# EAGLE design ChronoDotV2 (EAGLE 5.10)
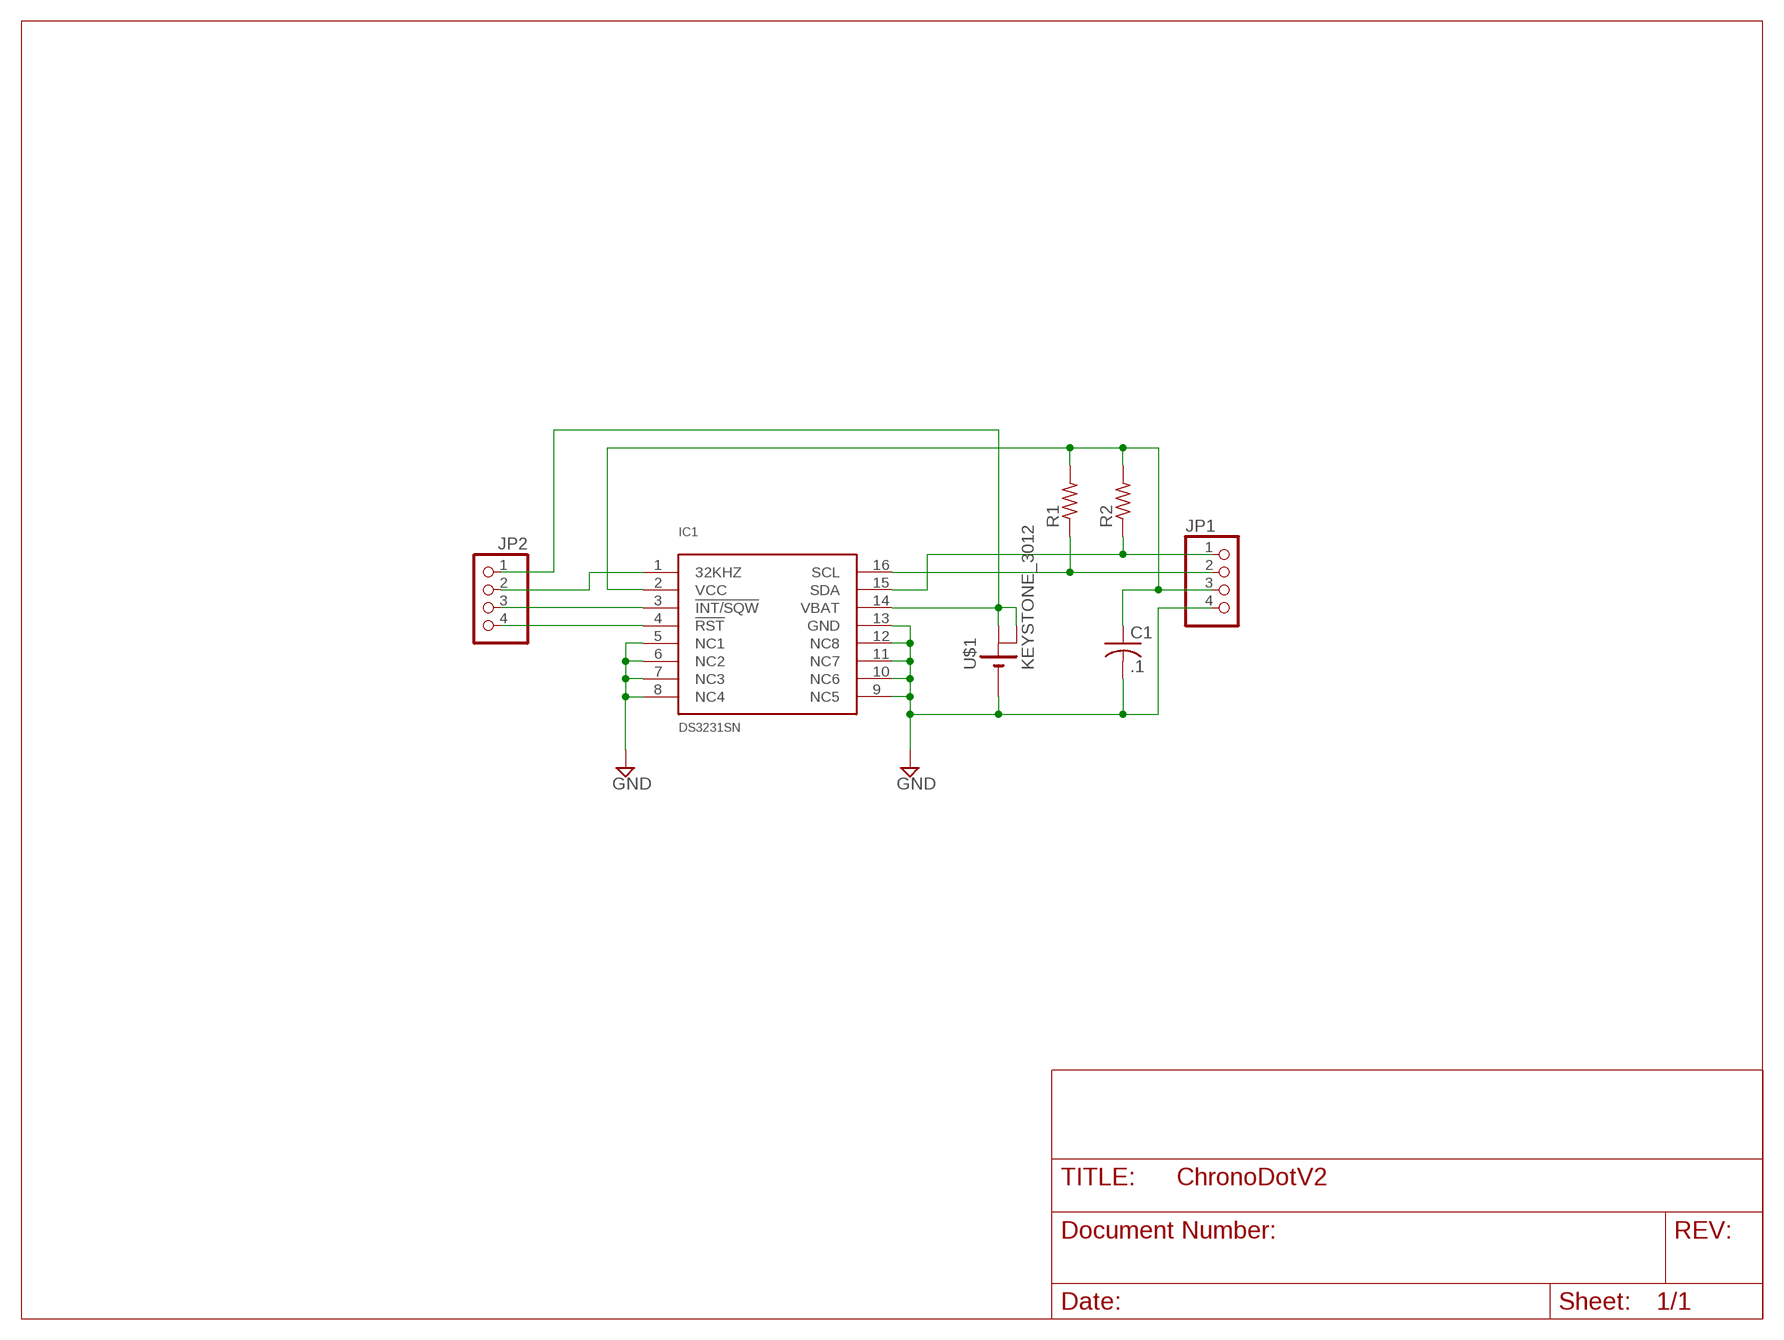
[diagram p0: schematic, sheet 1]

## Parts
C1  .1  C-USC0805  [C0805]
IC1  DS3231SN  [SO16W]
JP1  PINHD-1X4  [1X04]
JP2  PINHD-1X4  [1X04]
R1  R-US_0204/5  [0204/5]
R2  R-US_0204/5  [0204/5]
U$1  KEYSTONE_3012  [KEYSTONE_3012]

## Nets
GND: C1.2 IC1.5(NC1) IC1.6(NC2) IC1.7(NC3) IC1.8(NC4) IC1.9(NC5) IC1.10(NC6) IC1.11(NC7) IC1.12(NC8) IC1.13(GND) JP1.4 U$1.BAT-(-2)
N$1: C1.1 IC1.2(VCC) JP1.3 R1.2 R2.2
N$2: IC1.1(32KHZ) JP2.2
N$3: IC1.14(VBAT) JP2.1 U$1.BAT+1(+1) U$1.BAT+2(+2)
N$4: IC1.4(!RST) JP2.4
N$5: IC1.3(!INT/SQW) JP2.3
N$6: IC1.16(SCL) JP1.2 R1.1
N$7: IC1.15(SDA) JP1.1 R2.1

## Library data of the parts
C1 = rcl:C-US: CAPACITOR, American symbol
IC1 = comfile:DS3231SN
JP1 JP2 = pinhead:PINHD-1X4: PIN HEADER
R1 R2 = rcl:R-US_: RESISTOR, American symbol
U$1 = macetech:KEYSTONE_3012

## Board
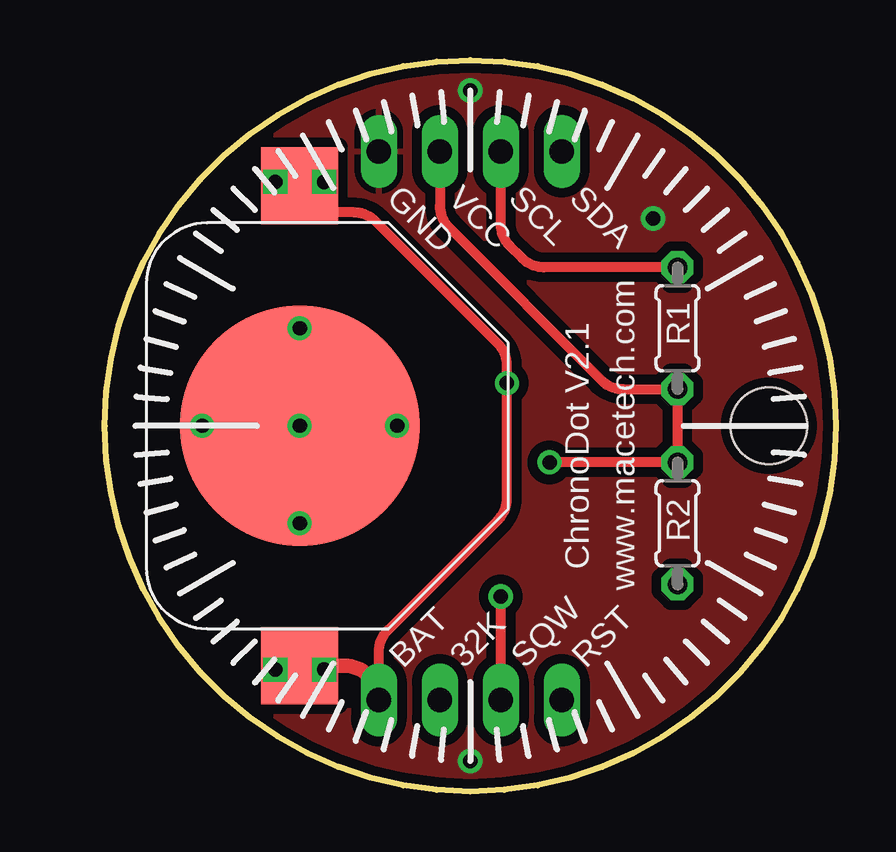
[diagram p1: board, top side]
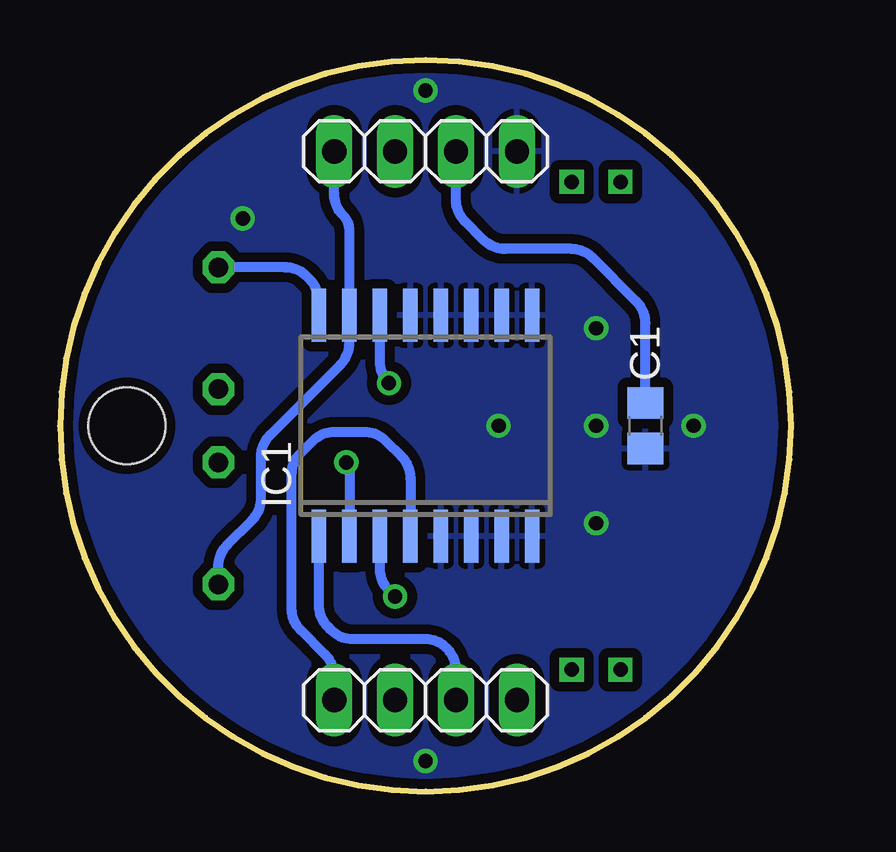
[diagram p2: board, bottom side, seen from below]

Size 30.48 x 30.48 mm. Coordinates in mm from the lower left corner, seen from the top.
Outline: 15.24,30.48 arc-90 30.48,15.24 arc-90 15.24,0 arc-90 0,15.24 arc-90 15.24,30.48
Copper layers (1*16): Top 0.035mm / dielectric 1.5mm / Bottom 0.035mm
Design rules "default *": minimum track width 10mil, minimum drill 24mil, track to track 8mil, track to pad 8mil, pad to pad 8mil, via to via 8mil, smd to smd 8mil, copper to edge 10mil, drill to drill 8mil, minimum pad ring 10mil, minimum via ring 8mil, stop-mask expansion 4mil, vias tented up to drill 25mil, thermal gap 10mil
Holes 3.2 mm at 27.69,15.24
tRestrict: area 0.8,7.9 to 15.5,22.6
Milling: 4 lines

### Footprints (pad centres in the part's own frame; a part is rotated, then mirrored left to right if it is on the bottom)
C0805 = smd 1.3 x 1.5: 1 -0.95,0; 2 0.95,0
SO16W = smd 0.6 x 2.2: 1 -4.445,-4.6; 2 -3.175,-4.6; 3 -1.905,-4.6; 4 -0.635,-4.6; 5 0.635,-4.6; 6 1.905,-4.6; 7 3.175,-4.6; 8 4.445,-4.6; 9 4.445,4.6; 10 3.175,4.6; 11 1.905,4.6; 12 0.635,4.6; 13 -0.635,4.6; 14 -1.905,4.6; 15 -3.175,4.6; 16 -4.445,4.6
1X04 = drill 1.016 long: 1 -3.81,0; 2 -1.27,0; 3 1.27,0; 4 3.81,0
0204/5 = drill 0.813 octagon: 1 -2.54,0; 2 2.54,0
KEYSTONE_3012 = smd 3.2 x 3.2: BAT+1 -10,0; BAT+2 10,0 | smd 10 x 10: BAT- 0,0

### Placement (x,y rotation side)
C1  6.07,15.24 270 bottom
IC1  15.24,15.24 0 bottom
JP1  15.24,26.67 0 bottom
JP2  15.24,3.81 180 bottom
R1  23.88,19.3 270 top
R2  23.88,11.18 90 top
U$1  8.13,15.24 90 top

### Tracks (layer width: path | path; a pad name or v marks a point on that pad's centre or on a via)
GND  (via drill 0.6)
  other vias: 8.13,15.24 8.13,19.3 4.06,15.24 8.13,11.18 12.19,15.24 22.86,23.88 15.24,1.27 15.24,29.21
  pour Top (isolate 0.406): 15.24,30.48 arc-90 30.48,15.24 arc-90 15.24,0 arc-90 0,15.24 arc-90
  pour Bottom (isolate 0.406): 0,15.24 arc-91 15.24,30.48 arc-90 30.48,15.24 arc-90 15.24,0 arc-90
N$1  (via drill 0.6)
  Top 0.406: JP1.3 13.97,24.4 arc45 14.34,23.5 20.71,17.14 arc45 21.61,16.76 R1.2 R2.2 v18.54,13.72
  Bottom 0.406: C1.1 6.07,19.52 arc-45 6.44,20.41 8.26,22.23 arc-45 9.16,22.61 11.92,22.61 arc45 12.82,22.98 13.6,23.76 arc45 13.97,24.66 JP1.3 | v18.54,13.72 18.41,13.59 IC1.2
N$2
  Bottom 0.406: JP2.2 13.97,5.06 arc-45 14.34,5.96 14.36,5.98 arc-45 15.26,6.35 18.27,6.35 arc45 19.17,6.72 19.31,6.87 arc45 19.68,7.76 IC1.1
N$3  (via drill 0.6)
  Top 0.406: U$1.BAT+2 9.24,24.13 10.4,24.13 arc-45 11.29,23.76 16.39,18.66 arc-45 16.76,17.76 v16.76,17.02 16.76,12.21 arc-45 16.39,11.31 11.8,6.72 arc45 11.43,5.82 JP2.1
  Top 0.61: JP2.1 arc90 10,5.24 U$1.BAT+1
  Bottom 0.406: v16.76,17.02 16.77,17.03 arc45 17.14,17.93 IC1.14
N$4
  Bottom 0.406: JP2.4 19.05,4.81 arc-45 19.42,5.71 20.46,6.74 arc45 20.83,7.64 20.83,13.19 arc45 20.46,14.09 19.93,14.61 arc45 19.03,14.99 17.8,14.99 arc45 16.9,14.61 16.25,13.96 arc45 15.88,13.06 IC1.4
N$5  (via drill 0.6)
  Top 0.406: JP2.3 v16.51,8.13
  Bottom 0.406: v16.51,8.13 16.77,8.39 arc45 17.14,9.29 IC1.3
N$6
  Top 0.406: R1.1 18.31,21.84 arc-45 17.41,22.22 16.88,22.74 arc-45 16.51,23.64 JP1.2
  Bottom 0.406: IC1.16 19.68,20.43 arc-45 20.06,21.33 20.2,21.47 arc-45 21.1,21.84 R1.1
N$7
  Bottom 0.406: JP1.1 19.05,24.91 arc-45 18.68,24.01 arc45 18.41,23.38 IC1.15 18.41,18.69 arc45 18.79,17.79 21.73,14.85 arc-45 22.1,13.95 22.1,12.21 arc45 22.47,11.31 23.5,10.28 arc-45 23.88,9.38 R2.1
N$8  (via drill 0.6)
  other vias: 7.11,25.4
N$9  (via drill 0.6)
  other vias: 9.14,25.4
N$10  (via drill 0.6)
  other vias: 7.11,5.08
N$11  (via drill 0.6)
  other vias: 9.14,5.08

### Text on the board
tNames: GND | VCC | SCL | SDA | ChronoDot V2.1 | www.macetech.com | BAT | 32K | SQW | RST